# EAGLE design igniter (EAGLE 7.1.0)
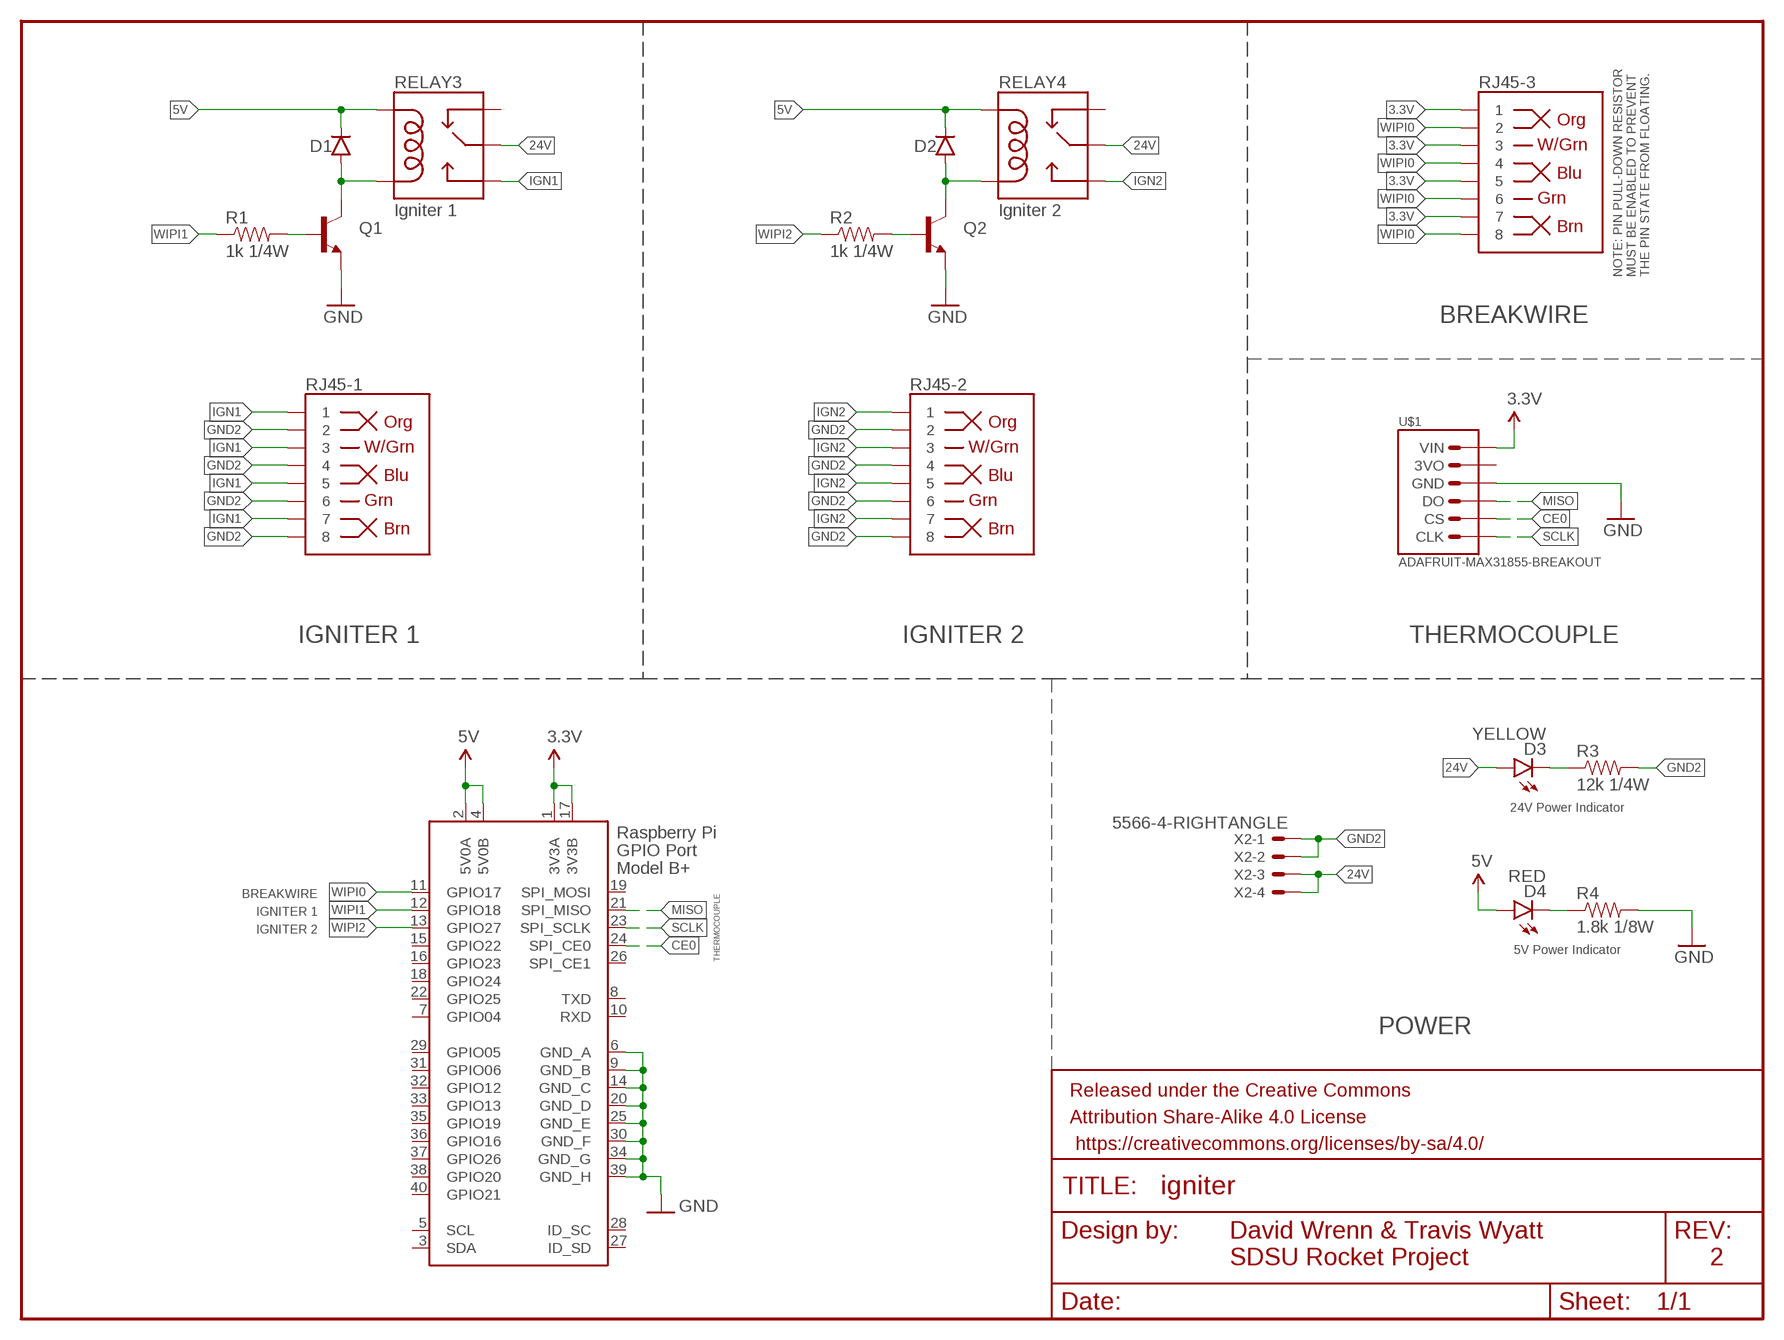
[diagram p0: schematic, sheet 1]

## Parts
D1  DIODEPTH  [DIODE-1N4001]
D2  DIODEPTH  [DIODE-1N4001]
D3  YELLOW  LED0603  [LED-0603]
D4  RED  LED0603  [LED-0603]
FRAME1  FRAME-LETTER  [CREATIVE_COMMONS]
Q1  TRANSISTOR_NPNP2N2222A  [TO-92]
Q2  TRANSISTOR_NPNP2N2222A  [TO-92]
R1  1k 1/4W  RESISTORAXIAL-0.3  [AXIAL-0.3]
R2  1k 1/4W  RESISTORAXIAL-0.3  [AXIAL-0.3]
R3  12k 1/4W  RESISTOR0603-RES  [0603-RES]
R4  1.8k 1/8W  RESISTOR0603-RES  [0603-RES]
RELAY3  Igniter 1  RELAYPTH  [RELAY-G5Q]
RELAY4  Igniter 2  RELAYPTH  [RELAY-G5Q]
RJ45-1  RJ45-8PTH  [RJ45-8]
RJ45-2  RJ45-8PTH  [RJ45-8]
RJ45-3  RJ45-8PTH  [RJ45-8]
U$1  ADAFRUIT-MAX31855-BREAKOUT  [ADAFRUIT-MAX31855]
X1  RASPI_BOARD_B+#_H  [RASPI_BOARD_B+HAT]
X2  5566-4-RIGHTANGLE  [5566-4]

## Nets
3.3V: RJ45-3.1 RJ45-3.3 RJ45-3.5 RJ45-3.7 U$1.VIN X1.1(3V3A) X1.17(3V3B)
5V: D1.C D2.C D4.A RELAY3.5(COIL1) RELAY4.5(COIL1) X1.2(5V0A) X1.4(5V0B)
24V: D3.A RELAY3.2(MAIN) RELAY4.2(MAIN) X2.3 X2.4
CE0: U$1.CS X1.24(SPI_CE0)
GND: Q1.3(E) Q2.3(E) R4.2 U$1.GND X1.6(GND_A) X1.9(GND_B) X1.14(GND_C) X1.20(GND_D) X1.25(GND_E) X1.30(GND_F) X1.34(GND_G) X1.39(GND_H)
GND2: R3.2 RJ45-1.2 RJ45-1.4 RJ45-1.6 RJ45-1.8 RJ45-2.2 RJ45-2.4 RJ45-2.6 RJ45-2.8 X2.1 X2.2
IGN1: RELAY3.3(NO) RJ45-1.1 RJ45-1.3 RJ45-1.5 RJ45-1.7
IGN2: RELAY4.3(NO) RJ45-2.1 RJ45-2.3 RJ45-2.5 RJ45-2.7
MISO: U$1.DO X1.21(SPI_MISO)
N$1: Q1.2(B) R1.P$2
N$2: D1.A Q1.1(C) RELAY3.1(COIL2)
N$3: D3.C R3.1
N$4: D4.C R4.1
N$5: Q2.2(B) R2.P$2
N$6: D2.A Q2.1(C) RELAY4.1(COIL2)
SCLK: U$1.CLK X1.23(SPI_SCLK)
WIPI0: RJ45-3.2 RJ45-3.4 RJ45-3.6 RJ45-3.8 X1.11(GPIO17)
WIPI1: R1.P$1 X1.12(GPIO18)
WIPI2: R2.P$1 X1.13(GPIO27)
Unconnected: RELAY3.4(NC) RELAY4.4(NC) U$1.3VO X1.3(SDA) X1.5(SCL) X1.7(GPIO04) X1.8(TXD) X1.10(RXD) X1.15(GPIO22) X1.16(GPIO23) X1.18(GPIO24) X1.19(SPI_MOSI) X1.22(GPIO25) X1.26(SPI_CE1) X1.27(ID_SD) X1.28(ID_SC) X1.29(GPIO05) X1.31(GPIO06) X1.32(GPIO12) X1.33(GPIO13) X1.35(GPIO19) X1.36(GPIO16) X1.37(GPIO26) X1.38(GPIO20) X1.40(GPIO21)

## Notes on the sheet
- NOTE: PIN PULL-DOWN RESISTOR
  MUST BE ENABLED TO PREVENT
  THE PIN STATE FROM FLOATING.
- BREAKWIRE
- IGNITER 1 | IGNITER 2 | THERMOCOUPLE
- 24V Power Indicator
- BREAKWIRE
- IGNITER 1
- IGNITER 2 | THERMOCOUPLE
- 5V Power Indicator
- POWER
- David Wrenn & Travis Wyatt
- SDSU Rocket Project
- 2

## Library data of the parts
D1 D2 = SparkFun-DiscreteSemi:DIODE: Diode These are standard reverse protection diodes and small signal diodes. SMA package can handle up to about 1A. SOD-323 can handle about 200mA. What the SOD-323 package when ordering, there are some mfgs out there that are 5-pin packages.
D3 D4 = SparkFun-LED:LED: LEDs Standard schematic elements and footprints for 5mm, 3mm, 1206, and 0603 sized LEDs. 5mm - Spark Fun Electronics SKU : COM-00529 (and others)
FRAME1 = SparkFun-Aesthetics:FRAME-LETTER: Schematic Frame Standard 8.5x11 US Letter frame; DESIGNER: NAME; VERSION: v01
Q1 Q2 = SparkFun-DiscreteSemi:TRANSISTOR_NPN: Generic NPN BJT MMBT2222A - TRANS-08049 (SOT-23, 1A 40V) MPSA42 - TRANS-09116 (SOT-23, 500mA 300V) MMBT5088LT1G - TRANS-11160 (SOT-23, 50 mA 30V) BC547 - COM-08928 <http://www.sparkfun.com/products/8928> (TO-92 45V 100mA) (1.Collector 2.Base 3.Emitter) 2N3904 - COM-00521 <http://www.sparkfun.com/products/521> (TO-92 40V 200mA) (1.Emitter 2.Base 3.Collector) P2N2222A - COM-12852 <http://www.sparkfun.com/products/12852> (TO-92 40V 600mA) (1.Collector 2.Base 3.Emitter); PROD_ID: TRANS-09536
R1-R4 = SparkFun-Resistors:RESISTOR: Resistor Basic schematic elements and footprints for 0603, 1206, and PTH resistors.
RELAY3 RELAY4 = SparkFun-Electromechanical:RELAY: SPDT relay (COM-00101)
RJ45-1-RJ45-3 = SparkFun-Connectors:RJ45-8: RJ45 Jack Simple RJ45, 8-pin connection - connector for common Cat5, Cat5e, and Cat6 Ethernet cables. Footprint not yet proven in production. Connector sku is PRT-00643; Breakout PCB sku is BOB-00716.; PROD_ID: CONN-08506; VALUE: RJ45
U$1 = SDSURocket-BreakoutBoards:ADAFRUIT-MAX31855: Adafruit MAX31855 Breakout K-Type Thermocouple Layout for the Adafruit MAX31855 Breakout board. Product ID: 269 <http://www.adafruit.com/product/269>
X1 = raspberrypi_bastelstube_v13:RASPI_BOARD_B+#: Raspberry Pi GPIO connector with markings for the outer dimensions of the Raspberry Pi board model B+ with different sets of drill holes or mounting pads All pins connected
X2 = SDSURocket-Connectors:5566-4: Mini FIT connector 4 pol Source: http://www.molex.com; OC_FARNELL: unknown; OC_NEWARK: unknown

## Board
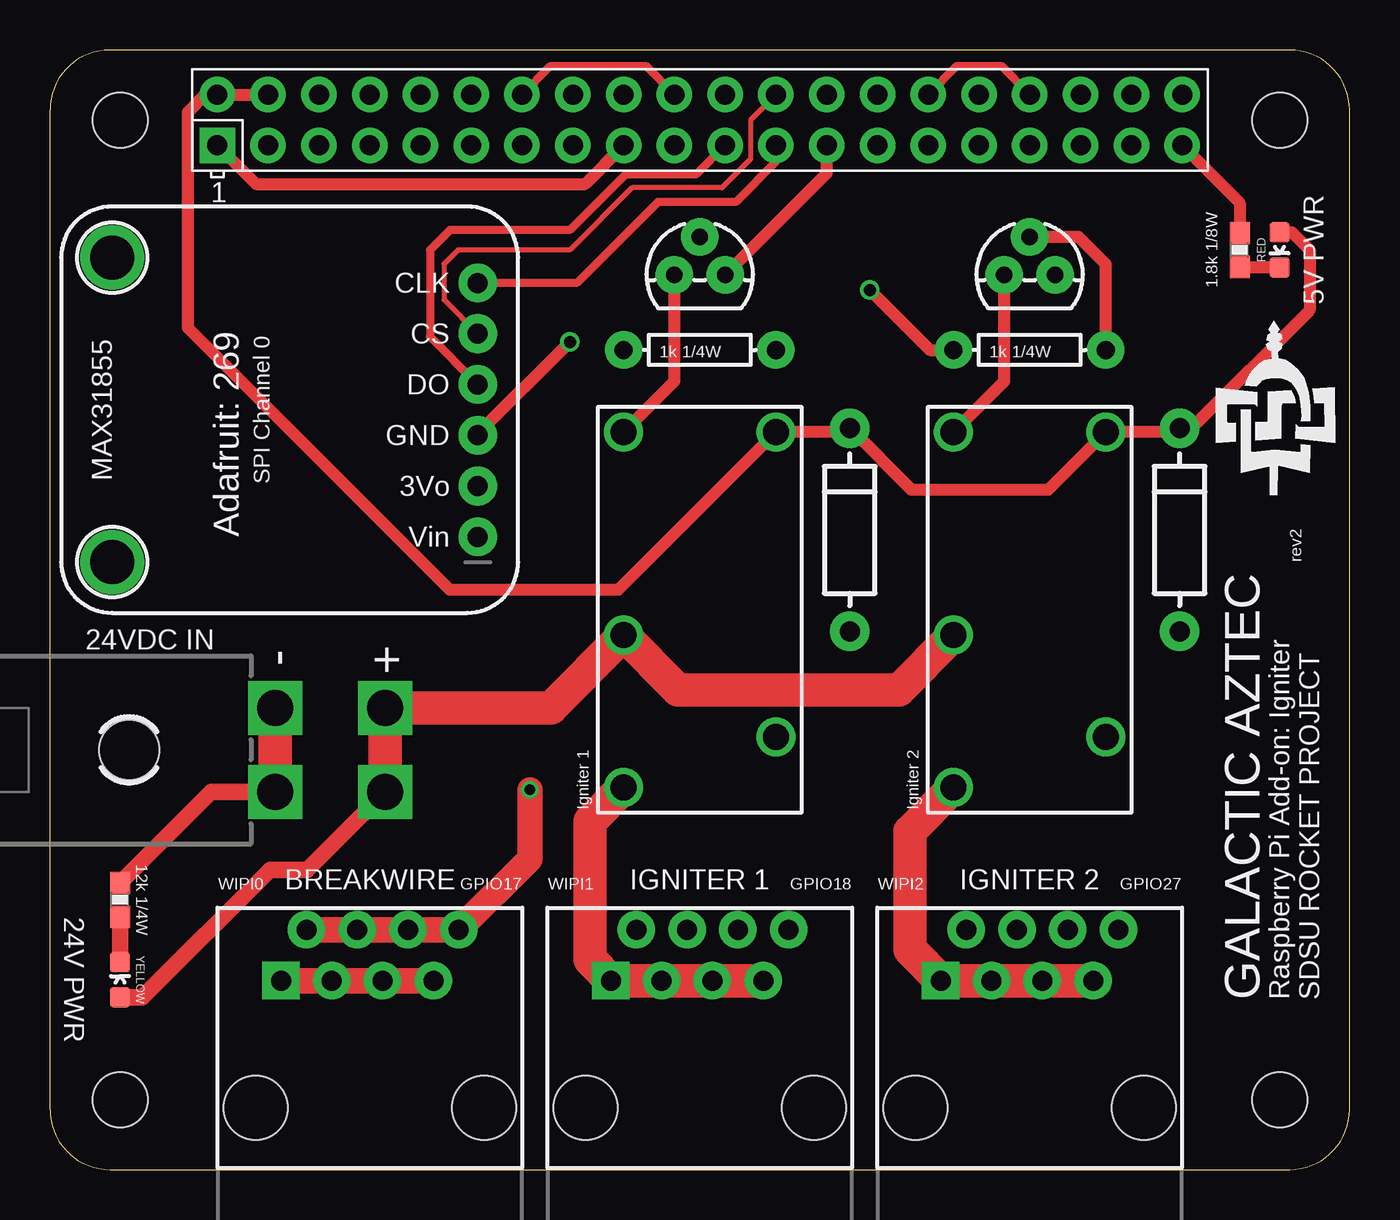
[diagram p1: board, top side]
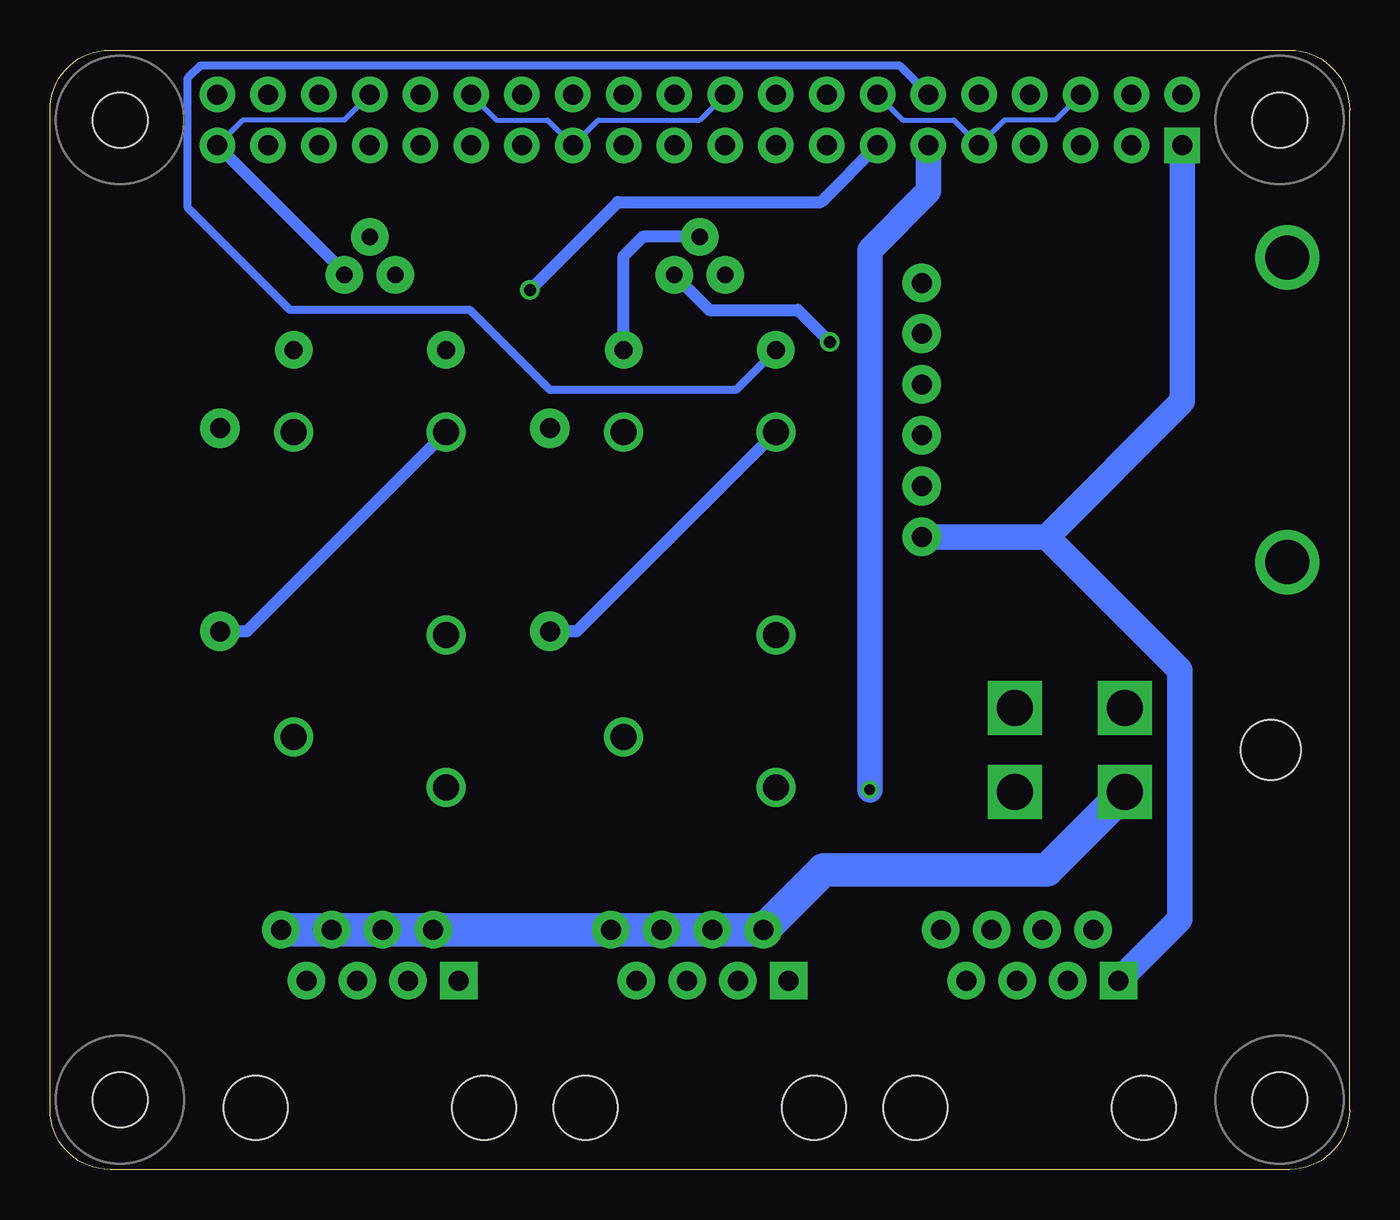
[diagram p2: board, bottom side, seen from below]

Size 65 x 56 mm. Coordinates in mm from the lower left corner, seen from the top.
Copper layers (1*16): Top 0.0356mm / dielectric 1.5011mm / Bottom 0.0356mm
Design rules "SparkFunBestPractices": minimum track width 10mil, minimum drill 13mil, track to track 10mil, track to pad 10mil, pad to pad 10mil, via to via 10mil, smd to smd 10mil, copper to edge 15mil, drill to drill 12mil, minimum pad ring 7mil, minimum via ring 7mil, stop-mask expansion 3mil, vias tented up to drill 0mil, thermal gap 10mil

### Footprints (pad centres in the part's own frame; a part is rotated, then mirrored left to right if it is on the bottom)
DIODE-1N4001 = drill 1 pad 1.981: A -5.08,0; C 5.08,0
LED-0603 = smd 1 x 1: A 0,-0.877; C 0,0.877
TO-92 = drill 0.813 pad 1.88: 1 -1.27,0; 2 0,1.905; 3 1.27,0
AXIAL-0.3 = drill 0.9 pad 1.88: P$1 -3.81,0; P$2 3.81,0
0603-RES = smd 1.1 x 1: 1 -0.85,0; 2 0.85,0
RELAY-G5Q = drill 1.3: 1 8.89,3.81; 2 -1.27,3.81; 3 -8.89,3.81; 4 -6.35,-3.81; 5 8.89,-3.81
RJ45-8 = drill 1 pad 1.88 square: 1 -4.445,6.35 | drill 1 pad 1.88: 2 -3.175,8.89; 3 -1.905,6.35; 4 -0.635,8.89; 5 0.635,6.35; 6 1.905,8.89; 7 3.175,6.35; 8 4.445,8.89 | hole 3.2: -5.715,0; 5.715,0
ADAFRUIT-MAX31855 = drill 1 pad 1.93: 3VO -3.81,-9.398; CLK 6.35,-9.398; CS 3.81,-9.398; DO 1.27,-9.398; GND -1.27,-9.398; VIN -6.35,-9.398 | drill 2.2 pad 3: P$1 -7.62,8.89; P$2 7.62,8.89
RASPI_BOARD_B+HAT = drill 1 pad 1.778 square: 1 8.37,51.23 | drill 1 pad 1.778: 2 8.37,53.77; 3 10.91,51.23; 4 10.91,53.77; 5 13.45,51.23; 6 13.45,53.77; 7 15.99,51.23; 8 15.99,53.77; 9 18.53,51.23; 10 18.53,53.77; 11 21.07,51.23; 12 21.07,53.77; 13 23.61,51.23; 14 23.61,53.77; 15 26.15,51.23; 16 26.15,53.77; 17 28.69,51.23; 18 28.69,53.77; 19 31.23,51.23; 20 31.23,53.77; 21 33.77,51.23; 22 33.77,53.77; 23 36.31,51.23; 24 36.31,53.77; 25 38.85,51.23; 26 38.85,53.77; 27 41.39,51.23; 28 41.39,53.77; 29 43.93,51.23; 30 43.93,53.77; 31 46.47,51.23; 32 46.47,53.77; 33 49.01,51.23; 34 49.01,53.77; 35 51.55,51.23; 36 51.55,53.77; 37 54.09,51.23; 38 54.09,53.77; 39 56.63,51.23; 40 56.63,53.77 | hole 2.75: 3.5,3.5; 3.5,52.5; 61.5,3.5; 61.5,52.5
5566-4 = drill 1.8 square: 1 2.1,-2.75; 2 -2.1,-2.75; 3 2.1,2.75; 4 -2.1,2.75 | hole 3: 0,-10.05

### Placement (x,y rotation side)
D1  40,32 90 top
D2  56.5,32 90 top
D3  3.5,9.5 0 top
D4  61.5,46 180 top
FRAME1  0,-17 0 top  (outside the outline)
Q1  32.5,44.75 0 top
Q2  49,44.75 0 top
R1  32.5,41 0 top
R2  49,41 0 top
R3  3.5,13.5 90 top
R4  59.5,46 90 top
RELAY3  32.5,28 90 top
RELAY4  49,28 90 top
RJ45-1  32.5,3.1 0 top
RJ45-2  49,3.1 0 top
RJ45-3  16,3.1 0 top
U$1  12,38 90 top
X1  0,0 0 top
X2  14,21 270 top

### Tracks (layer width: path | path; a pad name or v marks a point on that pad's centre or on a via)
3.3V
  Top 0.61: X1.1 10.3,49.3 26.76,49.3 X1.17
  Top 1.27: RJ45-3.7 RJ45-3.5 RJ45-3.3 RJ45-3.1
  Bottom 1.27: RJ45-3.1 8.5,12.51 8.5,25 15.15,31.65 | 15.15,31.65 U$1.VIN | X1.1 8.37,38.43 15.15,31.65
5V
  Top 0.61: D4.A 62.12,46.88 63,46 63,43 57.08,37.08 D2.C 56.31,36.89 RELAY4.5 49.92,34 43.08,34 D1.C 39.81,36.89 RELAY3.5 28.42,29 20,29 6.9,42.1 6.9,52.9 7.77,53.77 X1.2 X1.4
24V
  Top 0.813: D3.A 4.62,8.62 11,15 12.85,15 X2.3
  Top 1.676: X2.3 X2.4 25.06,23.1 RELAY3.2 31.42,24 42.46,24 RELAY4.2
CE0
  Top 0.254: X1.24 35.04,52.5 35.04,50.54 33.6,49.1 29.1,49.1 26,46 20.4,46 19.7,45.3 19.7,43.51 U$1.CS
GND  (via drill 0.6)
  Top 0.406: X1.14 25.04,55.2 29.8,55.2 X1.20 | X1.30 45.36,55.2 47.58,55.2 X1.34
  Top 0.61: X1.39 59.5,48.36 R4.2 | Q1.3 38.85,49.83 X1.25 | v26,41.4 21.4,36.8 U$1.GND
  Bottom 0.254: X1.6 14.72,52.5 17.26,52.5 X1.9 19.8,52.5 22.34,52.5 X1.14 | X1.20 32.5,52.5 37.58,52.5 X1.25 40.12,52.5 42.66,52.5 X1.30 | X1.34 50.28,52.5 55.36,52.5 X1.39
  Bottom 0.61: Q2.3 50.27,44.87 X1.39 | Q1.3 32.02,43 27.6,43 v26,41.4
GND2
  Top 0.813: R3.2 8.05,18.9 X2.1
  Top 1.676: X2.2 X2.1
  Bottom 1.676: X2.1 15.15,15 26.32,15 RJ45-1.2 RJ45-1.4 RJ45-1.6 RJ45-1.8 RJ45-2.2 RJ45-2.4 RJ45-2.6 RJ45-2.8
IGN1
  Top 1.676: RELAY3.3 27,17.42 27,10.51 RJ45-1.1 RJ45-1.3 RJ45-1.5 RJ45-1.7
IGN2
  Top 1.676: RELAY4.3 43,16.92 43,11.01 RJ45-2.1 RJ45-2.3 RJ45-2.5 RJ45-2.7
MISO
  Top 0.406: X1.21 32.34,49.8 28.8,49.8 26,47 20,47 19,46 19,41.67 U$1.DO
N$1
  Bottom 0.61: Q1.2 35.34,46.66 36.31,45.69 R1.P$2
N$2
  Top 0.61: RELAY3.1 31.23,39.43 Q1.1
  Bottom 0.61: RELAY3.1 38.66,26.92 D1.A
N$3
  Top 0.813: R3.1 D3.C
N$4
  Top 0.61: D4.C 59.53,45.12 R4.1
N$5
  Top 0.61: Q2.2 51.45,46.66 52.81,45.29 R2.P$2
N$6
  Top 0.61: RELAY4.1 47.73,39.43 Q2.1
  Bottom 0.61: RELAY4.1 55.16,26.92 D2.A
SCLK
  Top 0.406: X1.23 36.31,50.41 34.3,48.4 30.4,48.4 26.35,44.35 U$1.CLK
WIPI0  (via drill 0.51)
  Top 1.27: RJ45-3.2 RJ45-3.4 RJ45-3.6 RJ45-3.8 24,15.54 v24,19
  Bottom 1.27: X1.11 21.07,48.93 24,46 v24,19
WIPI1
  Bottom 0.406: X1.12 22.5,55.2 57.5,55.2 58.1,54.6 58.1,48.1 53,43 44,43 40,39 30.69,39 R1.P$1
WIPI2  (via drill 0.6)
  Top 0.61: v41,44 44,41 R2.P$1
  Bottom 0.61: X1.13 26.44,48.4 36.6,48.4 v41,44

### Text on the board
tNames: 5V PWR | SPI Channel 0 | rev2 | 24VDC IN | - | + | WIPI0 | BREAKWIRE | GPIO17 | WIPI1 | IGNITER 1 | GPIO18 | WIPI2 | IGNITER 2 | GPIO27 | 24V PWR | GALACTIC AZTEC | Raspberry Pi Add-on: Igniter | SDSU ROCKET PROJECT